# EAGLE schematic bottom (EAGLE 7.6.0)
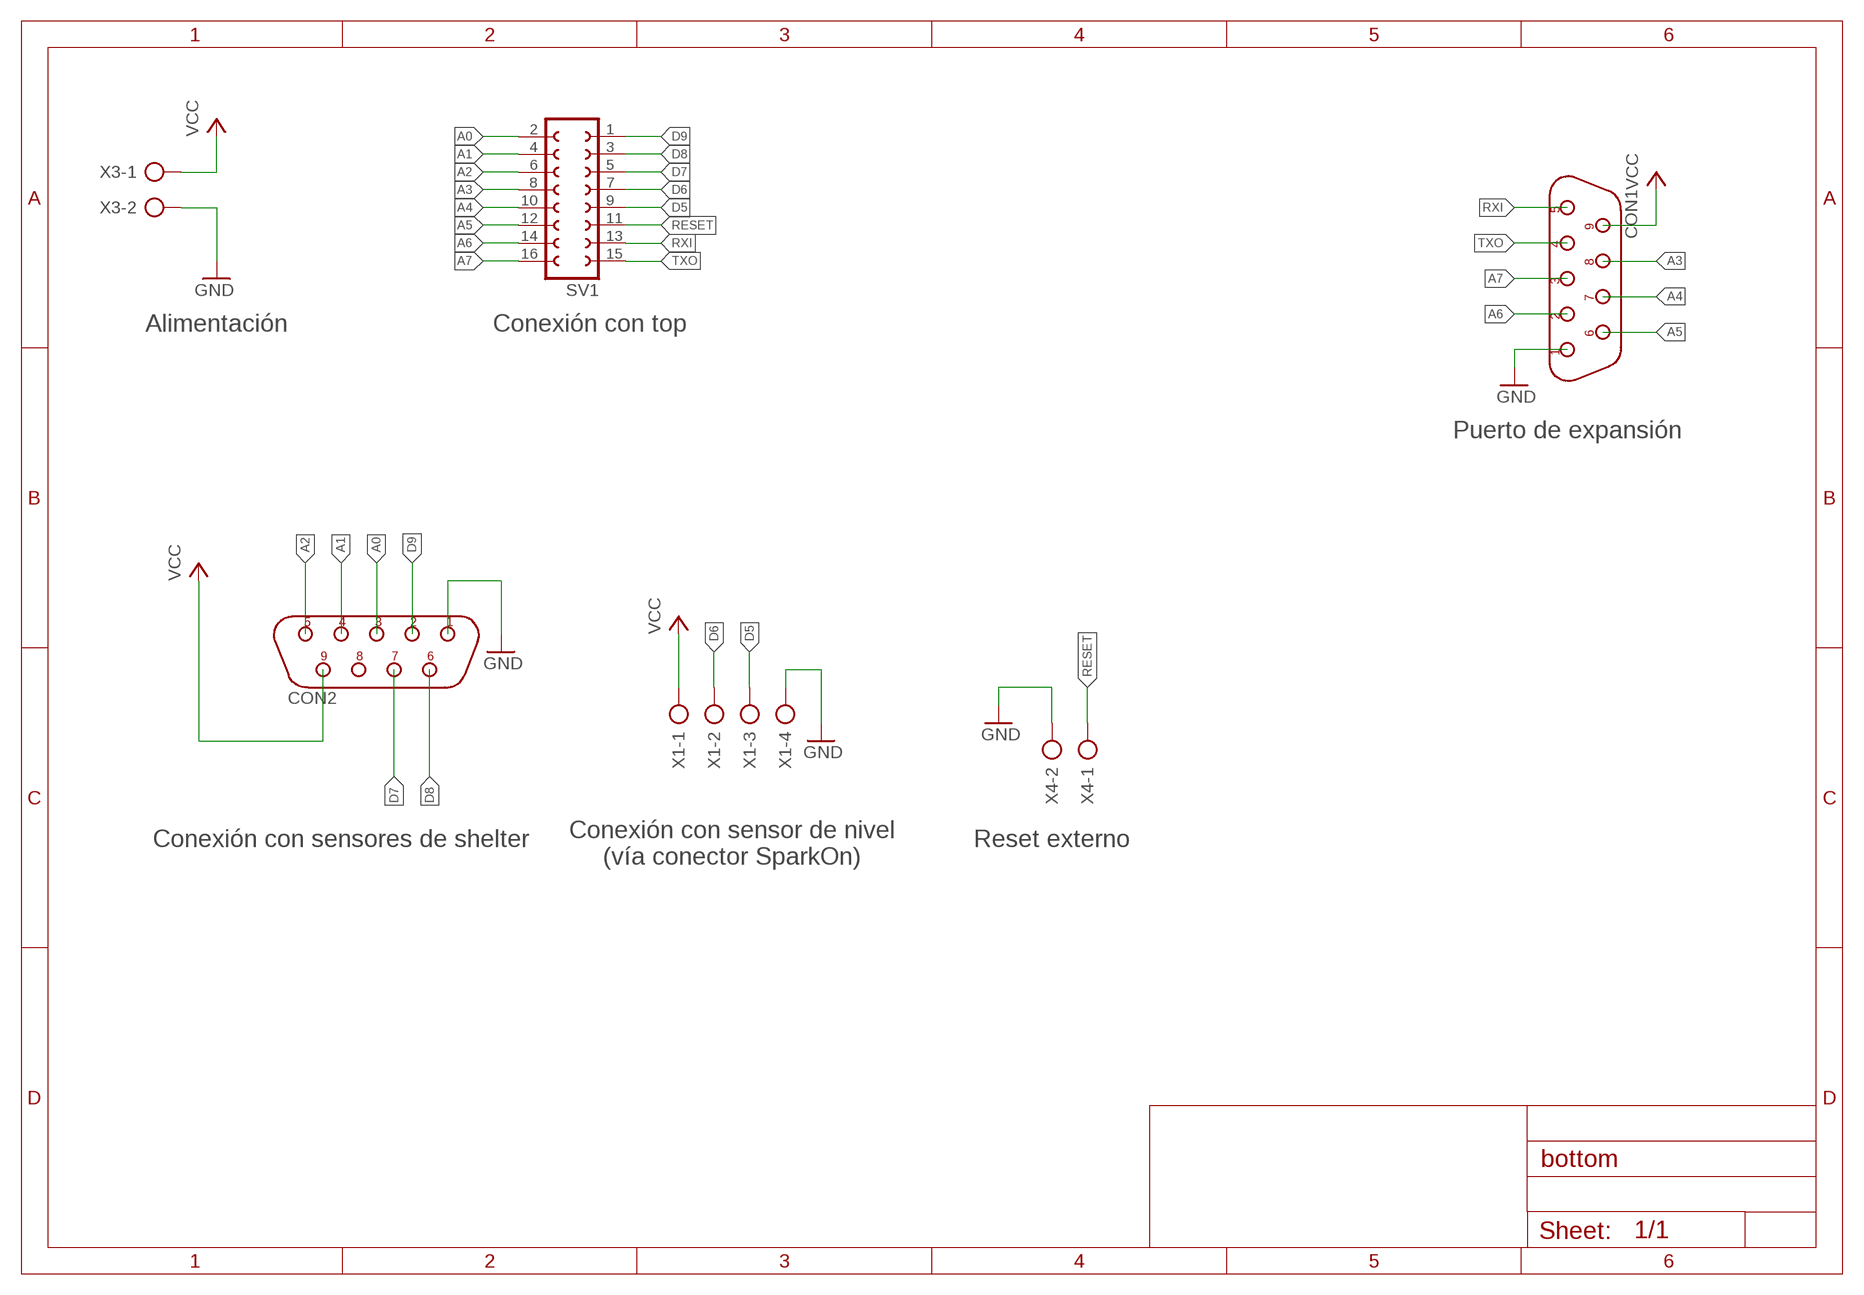
[diagram p0: schematic, sheet 1]

## Parts
CON1  DB9M/90  [D-09M/90]
CON2  DB9M/90  [D-09M/90]
SV1  FE08-2  [FE08-2]
X1  AK500/4  [AK500/4]
X3  AK500/2  [AK500/2]
X4  AK500/2  [AK500/2]

## Nets
A0: CON2.3 SV1.2
A1: CON2.4 SV1.4
A2: CON2.5 SV1.6
A3: CON1.8 SV1.8
A4: CON1.7 SV1.10
A5: CON1.6 SV1.12
A6: CON1.2 SV1.14
A7: CON1.3 SV1.16
D5: SV1.9 X1.3
D6: SV1.7 X1.2
D7: CON2.7 SV1.5
D8: CON2.6 SV1.3
D9: CON2.2 SV1.1
GND: CON1.1 CON2.1 X1.4 X3.2 X4.2
RESET: SV1.11 X4.1
RXI: CON1.5 SV1.13
TXO: CON1.4 SV1.15
VCC: CON1.9 CON2.9 X1.1 X3.1
Unconnected: CON2.8

## Notes on the sheet
- Alimentación | Conexión con top
- Puerto de expansión
- Conexión con sensores de shelter | Reset externo
- Conexión con sensor de nivel
  (vía conector SparkOn)

## Library data of the parts
CON1 CON2 = connect:DB9M/90
SV1 = con-lsta:FE08-2: FEMALE HEADER; OC_FARNELL: unknown; OC_NEWARK: unknown
X1 = con-ptr500:AK500/4: CONNECTOR; OC_FARNELL: unknown; OC_NEWARK: unknown
X3 X4 = con-ptr500:AK500/2: CONNECTOR; OC_FARNELL: unknown; OC_NEWARK: unknown

## Net classes
0 default: width 0.203 mm
1 vcc: width 0.254 mm